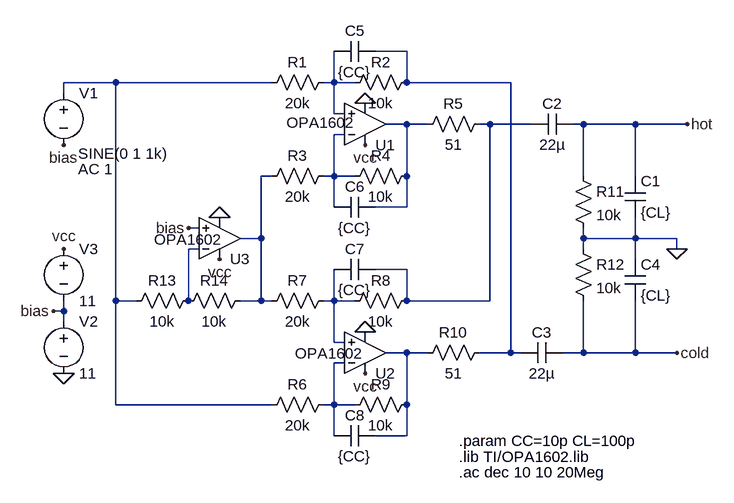
[diagram p0: schematic LineDriver-ac.asc]
LineDriver-ac.asc, the LTspice schematic file:
Version 4
SHEET 1 880 680
WIRE -432 -432 -480 -432
WIRE -880 -384 -960 -384
WIRE -640 -384 -880 -384
WIRE -544 -384 -544 -432
WIRE -544 -384 -560 -384
WIRE -512 -384 -544 -384
WIRE -432 -384 -432 -432
WIRE -272 -384 -432 -384
WIRE -960 -368 -960 -384
WIRE -544 -336 -544 -384
WIRE -528 -336 -544 -336
WIRE -432 -320 -464 -320
WIRE -400 -320 -432 -320
WIRE -304 -320 -320 -320
WIRE -240 -320 -304 -320
WIRE -160 -320 -176 -320
WIRE -80 -320 -160 -320
WIRE 0 -320 -80 -320
WIRE -528 -304 -544 -304
WIRE -640 -240 -656 -240
WIRE -544 -240 -544 -304
WIRE -544 -240 -560 -240
WIRE -512 -240 -544 -240
WIRE -432 -240 -432 -320
WIRE -160 -240 -160 -320
WIRE -80 -240 -80 -320
WIRE -544 -192 -544 -240
WIRE -432 -192 -432 -240
WIRE -432 -192 -480 -192
WIRE -752 -160 -768 -160
WIRE -656 -144 -656 -240
WIRE -656 -144 -688 -144
WIRE -160 -144 -160 -160
WIRE -80 -144 -80 -176
WIRE -80 -144 -160 -144
WIRE -16 -144 -80 -144
WIRE -752 -128 -768 -128
WIRE -160 -128 -160 -144
WIRE -16 -128 -16 -144
WIRE -80 -112 -80 -144
WIRE -432 -96 -480 -96
WIRE -880 -48 -880 -384
WIRE -848 -48 -880 -48
WIRE -768 -48 -768 -128
WIRE -656 -48 -656 -144
WIRE -656 -48 -688 -48
WIRE -640 -48 -656 -48
WIRE -544 -48 -544 -96
WIRE -544 -48 -560 -48
WIRE -512 -48 -544 -48
WIRE -432 -48 -432 -96
WIRE -304 -48 -304 -320
WIRE -304 -48 -432 -48
WIRE -960 -32 -960 -48
WIRE -960 -32 -976 -32
WIRE -960 -16 -960 -32
WIRE -544 16 -544 -48
WIRE -528 16 -544 16
WIRE -432 32 -464 32
WIRE -400 32 -432 32
WIRE -272 32 -272 -384
WIRE -272 32 -320 32
WIRE -256 32 -272 32
WIRE -160 32 -160 -48
WIRE -160 32 -192 32
WIRE -80 32 -80 -48
WIRE -80 32 -160 32
WIRE -16 32 -80 32
WIRE -528 48 -544 48
WIRE -880 112 -880 -48
WIRE -640 112 -880 112
WIRE -544 112 -544 48
WIRE -544 112 -560 112
WIRE -512 112 -544 112
WIRE -432 112 -432 32
WIRE -544 160 -544 112
WIRE -432 160 -432 112
WIRE -432 160 -480 160
FLAG -16 -128 0
FLAG 0 -320 hot
FLAG -16 32 cold
FLAG -960 64 0
FLAG -976 -32 bias
FLAG -768 -160 bias
FLAG -960 -128 vcc
FLAG -960 -288 bias
FLAG -496 -352 0
FLAG -496 0 0
FLAG -720 -176 0
FLAG -496 -288 vcc
FLAG -496 64 vcc
FLAG -720 -112 vcc
SYMBOL voltage -960 -384 R0
WINDOW 3 22 109 Left 2
WINDOW 123 22 133 Left 2
WINDOW 39 22 137 Left 2
SYMATTR Value SINE(0 1 1k)
SYMATTR Value2 AC 1
SYMATTR InstName V1
SYMBOL res -544 -400 R90
WINDOW 0 0 56 VBottom 2
WINDOW 3 32 56 VTop 2
SYMATTR InstName R1
SYMATTR Value 20k
SYMBOL res -416 -400 R90
WINDOW 0 0 56 VBottom 2
WINDOW 3 32 56 VTop 2
SYMATTR InstName R2
SYMATTR Value 10k
SYMBOL res -544 -256 R90
WINDOW 0 0 56 VBottom 2
WINDOW 3 32 56 VTop 2
SYMATTR InstName R3
SYMATTR Value 20k
SYMBOL res -416 -256 R90
WINDOW 0 0 56 VBottom 2
WINDOW 3 32 56 VTop 2
SYMATTR InstName R4
SYMATTR Value 10k
SYMBOL res -416 -304 R270
WINDOW 0 32 56 VTop 2
WINDOW 3 0 56 VBottom 2
SYMATTR InstName R5
SYMATTR Value 51
SYMBOL res -544 96 R90
WINDOW 0 0 56 VBottom 2
WINDOW 3 32 56 VTop 2
SYMATTR InstName R6
SYMATTR Value 20k
SYMBOL res -544 -64 R90
WINDOW 0 0 56 VBottom 2
WINDOW 3 32 56 VTop 2
SYMATTR InstName R7
SYMATTR Value 20k
SYMBOL res -416 -64 R90
WINDOW 0 0 56 VBottom 2
WINDOW 3 32 56 VTop 2
SYMATTR InstName R8
SYMATTR Value 10k
SYMBOL res -416 96 R90
WINDOW 0 0 56 VBottom 2
WINDOW 3 32 56 VTop 2
SYMATTR InstName R9
SYMATTR Value 10k
SYMBOL res -416 48 R270
WINDOW 0 32 56 VTop 2
WINDOW 3 0 56 VBottom 2
SYMATTR InstName R10
SYMATTR Value 51
SYMBOL res -176 -256 R0
SYMATTR InstName R11
SYMATTR Value 10k
SYMBOL res -176 -144 R0
SYMATTR InstName R12
SYMATTR Value 10k
SYMBOL cap -240 -304 R270
WINDOW 0 32 32 VTop 2
WINDOW 3 0 32 VBottom 2
SYMATTR InstName C2
SYMATTR Value 22µ
SYMBOL cap -256 48 R270
WINDOW 0 32 32 VTop 2
WINDOW 3 0 32 VBottom 2
SYMATTR InstName C3
SYMATTR Value 22µ
SYMBOL res -752 -64 R90
WINDOW 0 0 56 VBottom 2
WINDOW 3 32 56 VTop 2
SYMATTR InstName R13
SYMATTR Value 10k
SYMBOL res -672 -64 R90
WINDOW 0 0 56 VBottom 2
WINDOW 3 32 56 VTop 2
SYMATTR InstName R14
SYMATTR Value 10k
SYMBOL voltage -960 -32 R0
WINDOW 123 0 0 Left 0
WINDOW 39 0 0 Left 0
SYMATTR InstName V2
SYMATTR Value 11
SYMBOL Opamps\\opamp2 -496 -256 M180
WINDOW 3 -121 66 Left 2
SYMATTR Value OPA1602
SYMATTR InstName U1
SYMBOL Opamps\\opamp2 -496 96 M180
WINDOW 3 -108 63 Left 2
SYMATTR Value OPA1602
SYMATTR InstName U2
SYMBOL Opamps\\opamp2 -720 -80 M180
WINDOW 3 -101 62 Left 2
SYMATTR Value OPA1602
SYMATTR InstName U3
SYMBOL voltage -960 -144 R0
WINDOW 123 0 0 Left 0
WINDOW 39 0 0 Left 0
SYMATTR InstName V3
SYMATTR Value 11
SYMBOL cap -96 -240 R0
SYMATTR InstName C1
SYMATTR Value {CL}
SYMBOL cap -96 -112 R0
SYMATTR InstName C4
SYMATTR Value {CL}
SYMBOL cap -480 -448 R90
WINDOW 0 0 32 VBottom 2
WINDOW 3 32 32 VTop 2
SYMATTR InstName C5
SYMATTR Value {CC}
SYMBOL cap -480 -208 R90
WINDOW 0 0 32 VBottom 2
WINDOW 3 32 32 VTop 2
SYMATTR InstName C6
SYMATTR Value {CC}
SYMBOL cap -480 -112 R90
WINDOW 0 0 32 VBottom 2
WINDOW 3 32 32 VTop 2
SYMATTR InstName C7
SYMATTR Value {CC}
SYMBOL cap -480 144 R90
WINDOW 0 0 32 VBottom 2
WINDOW 3 32 32 VTop 2
SYMATTR InstName C8
SYMATTR Value {CC}
TEXT -352 216 Left 2 !.ac dec 10 10 20Meg
TEXT -352 168 Left 2 !.param CC=10p CL=100p
TEXT -352 192 Left 2 !.lib TI/OPA1602.lib

The netlist it stands for:
* LineDriver-ac.asc
V1 N002 bias SINE(0 1 1k) AC 1
R1 N003 N002 20k
R2 N001 N003 10k
R3 N006 N007 20k
R4 N004 N006 10k
R5 N004 N005 51
R6 N011 N002 20k
R7 N009 N007 20k
R8 N005 N009 10k
R9 N010 N011 10k
R10 N010 N001 51
R11 hot 0 10k
R12 0 cold 10k
C2 N005 hot 22µ
C3 N001 cold 22µ
R13 N008 N002 10k
R14 N007 N008 10k
V2 bias 0 11
XU1 N003 N006 vcc 0 N004 OPA1602  ; pins In+ In- V+ V- OUT
XU2 N009 N011 vcc 0 N010 OPA1602  ; pins In+ In- V+ V- OUT
XU3 bias N008 vcc 0 N007 OPA1602  ; pins In+ In- V+ V- OUT
V3 vcc bias 11
C1 hot 0 {CL}
C4 0 cold {CL}
C5 N001 N003 {CC}
C6 N004 N006 {CC}
C7 N005 N009 {CC}
C8 N010 N011 {CC}
.ac dec 10 10 20Meg
.param CC=10p CL=100p
.lib TI/OPA1602.lib
.backanno
.end